# EAGLE design ext_motor_M (EAGLE 9.6.2)
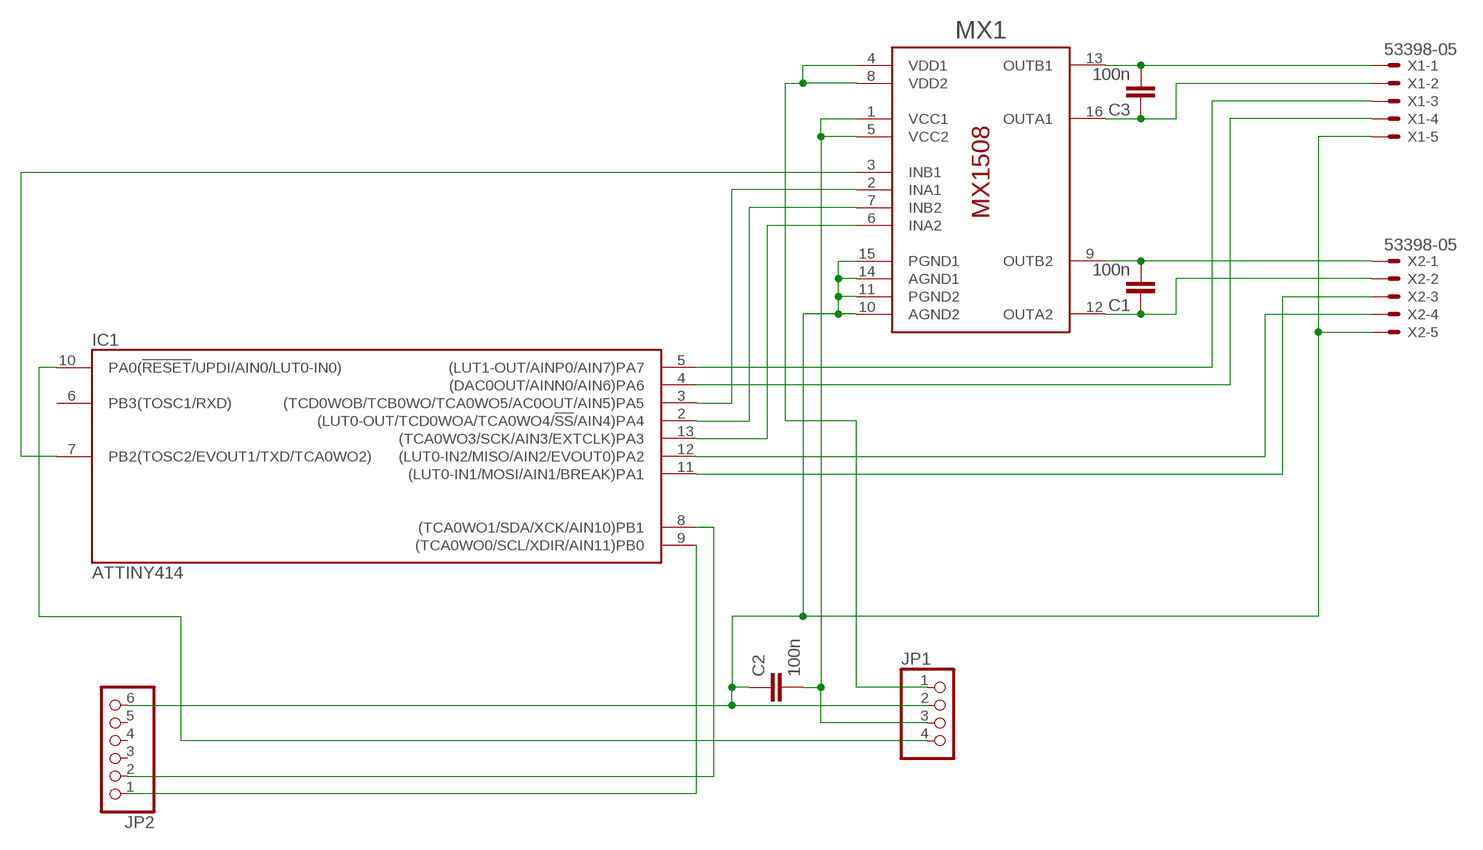
[diagram p0: schematic, sheet 1]

## Parts
C1  100n  C-EUC0805K  [C0805K]
C2  100n  C-EUC0805K  [C0805K]
C3  100n  C-EUC0805K  [C0805K]
IC1  ATTINY414  ATTINY414-SSN  [SO14]
JP1  PINHD-1X4  [1X04]
JP2  PINHD-1X6  [1X06]
MX1  MX1508  [SOP16]
X1  53398-05  [53398-05]
X2  53398-05  [53398-05]

## Nets
FOTO1: IC1.5((LUT1-OUT/AINP0/AIN7)PA7) X1.3
FOTO2: IC1.12((LUT0-IN2/MISO/AIN2/EVOUT0)PA2) X2.4
GND: C2.1 JP1.2 JP2.6 MX1.10(AGND2) MX1.11(PGND2) MX1.14(AGND1) MX1.15(PGND1) X1.5 X2.5
INA1: IC1.3((TCD0WOB/TCB0WO/TCA0WO5/AC0OUT/AIN5)PA5) MX1.2(INA1)
INA2: IC1.13((TCA0WO3/SCK/AIN3/EXTCLK)PA3) MX1.6(INA2)
INB1: IC1.7(PB2(TOSC2/EVOUT1/TXD/TCA0WO2)) MX1.3(INB1)
INB2: IC1.2((LUT0-OUT/TCD0WOA/TCA0WO4/!SS!/AIN4)PA4) MX1.7(INB2)
LED1: IC1.4((DAC0OUT/AINN0/AIN6)PA6) X1.4
LED2: IC1.11((LUT0-IN1/MOSI/AIN1/BREAK)PA1) X2.3
M1: C3.2 MX1.13(OUTB1) X1.1
M2: C3.1 MX1.16(OUTA1) X1.2
M3: C1.2 MX1.9(OUTB2) X2.1
M4: C1.1 MX1.12(OUTA2) X2.2
M_SRC: JP1.1 MX1.4(VDD1) MX1.8(VDD2)
N$7: IC1.10(PA0(!RESET!/UPDI/AIN0/LUT0-IN0)) JP1.4
N$19: IC1.9((TCA0WO0/SCL/XDIR/AIN11)PB0) JP2.1
N$20: IC1.8((TCA0WO1/SDA/XCK/AIN10)PB1) JP2.2
VCC: C2.2 JP1.3 MX1.1(VCC1) MX1.5(VCC2)
Unconnected: IC1.6(PB3(TOSC1/RXD)) JP2.3 JP2.4 JP2.5

## Power pins joined to a net without a drawn wire
GND: IC1.14(GND)
VCC: IC1.1(VCC)

## Library data of the parts
C1-C3 = rcl:C-EU: CAPACITOR, European symbol; SPICEPREFIX: C
IC1 = atmel:ATTINY*14: 8-bit AVR tiny-1-series Microcontroller CPU: two-cycle hardware multiplier single pin Unified Program Debug Interface (UPDI) programmable watchdog timer with separate on-chip oscillator programmable brown-out detection circuit with software disable function internal calibrated oscillator Status aktiv aktiv aktiv aktiv ATtiny214 ATtiny414 ATtiny814 ATtiny1614 General purpose working registers 32 SRAM 128 B 256 B 512 B 2 kB Program flash memory 2 kB 4 kB 8 kB 16 kB EEPROM 64 B 128 B 128 B 256 B 16-bit Timer/Counter type A (TCA) 1 16-bit Timer/Counter type B (TCB) 1 2 12-bit Timer/Counter type D (TCD) 1 Real Time Counter (RTC) 1 USART 1 SPI 1 TWI (I2C) 1 ADC 1 2 ADC channels 10 10+4 ADC resolution 10 bit DAC 1 3 AC 1 3 Peripheral Touch Controller (PTC) - 1 PTC number of self-capacitance channels - 6 PTC number of mutual-capacitance channels - 9 Custom Configurable Logic/Lookup tables 1/2 Window Watchdog 1 Event System channels 6 General purpose I/O 12 External interrupts 12 CRCSCAN 1 Operating voltage 1.8 ... 5.5 V Speed grade 0 ... 5 MHz @ 1.8 ... 5.5 V 0 ... 10 MHz @ 2.7 ... 5.5 V 0 ... 20 MHz @ 4.5 ... 5.5 V Clock options internal 16/20 MHz low power RC oscillator internal 32.768 kHz ultra low power RC oscillator external 32.768 kHz low-frequency crystal oscillator external clock input Pin Name Other/Special ADC0 ADC1 PTC AC0 AC1 AC2 DAC0 USART0 SPI0 TWI0 TCA0 TCBn TCD0 CCL PA0 !RESET, UPDI AIN0 LUT0-IN0 PA1 AIN1 TxD MOSI SDA LUT0-IN1 PA2 EVOUT0 AIN2 RxD MISO SCL LUT0-IN2 PA3 EXTCLK AIN3 XCK SCK WO3 TCB1 WO PA4 AIN4 AIN0 X0/Y0 XDIR !SS WO4 WOA LUT0-OUT PA5 VREFA AIN5 AIN1 X1/Y1 OUT AINN0 WO5 TCB0 WO WOB PA6 AIN6 AIN2 X2/Y2 AINN0 AINP1 AINP0 OUT PA7 AIN7 AIN3 X3/Y3 AINP0 AINP0 AINN0 LUT1-OUT PB3 TOSC1 OUT RxD WO0 PB2 TOSC2, EVOUT1 OUT TxD WO2 PB1 AIN10 X4/Y4 AINP2 XCK SDA WO1 PB0 AIN11 X5/Y5 AINP2 AINP1 XDIR SCL WO0 only available in devices with 8/16KByte flash, X- or Y-line only available in device ATtiny1614
JP1 = pinhead2:PINHD-1X4: PIN HEADER
JP2 = pinhead2:PINHD-1X6: PIN HEADER
MX1 = hugo:MX1508
X1 X2 = con-molex:53?-05: CONNECTOR wire to board 1.25 mm (.049 inch) pitch header; MF: MOLEX; OC_FARNELL: 1125354; OC_NEWARK: unknown

## Board
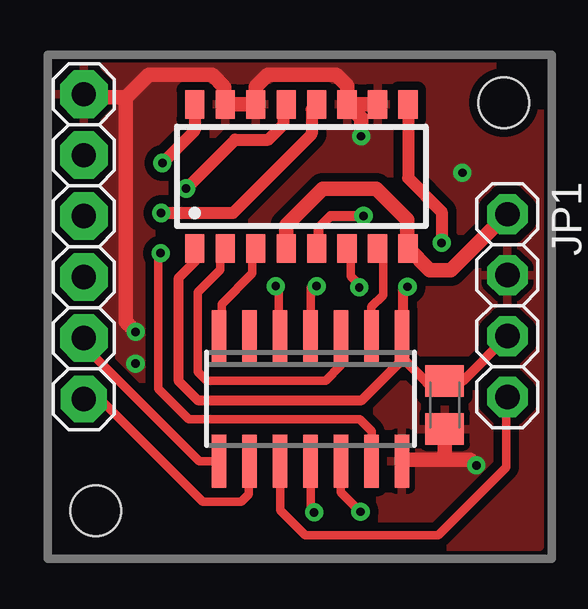
[diagram p1: board, top side]
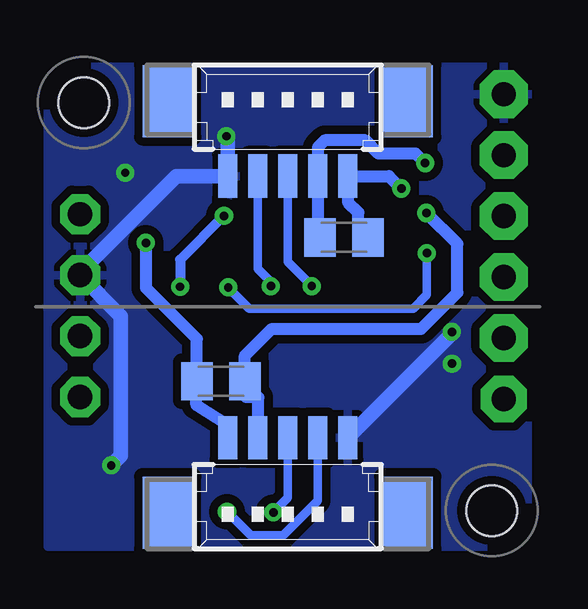
[diagram p2: board, bottom side, seen from below]

No outline drawn. Coordinates in mm, seen from the top.
Copper layers (1*16): Top 0.035mm / dielectric 1.5mm / Bottom 0.035mm
Design rules "default *": minimum track width 12mil, minimum drill 0.35mm, track to track 14mil, track to pad 13mil, pad to pad 10mil, via to via 14mil, smd to smd 14mil, copper to edge 15mil, drill to drill 15mil, minimum pad ring 10mil, minimum via ring 8mil, stop-mask expansion 4mil, vias tented up to drill 0mil, thermal gap 10mil
Holes 2.1 mm at 2,2 19,19

### Footprints (pad centres in the part's own frame; a part is rotated, then mirrored left to right if it is on the bottom)
C0805K = smd 1.3 x 1.6: 1 -1,0; 2 1,0
SO14 = smd 0.6 x 2.2: 1 -3.81,-2.6; 2 -2.54,-2.6; 3 -1.27,-2.6; 4 0,-2.6; 5 1.27,-2.6; 6 2.54,-2.6; 7 3.81,-2.6; 8 3.81,2.6; 9 2.54,2.6; 10 1.27,2.6; 11 0,2.6; 12 -1.27,2.6; 13 -2.54,2.6; 14 -3.81,2.6
1X04 = drill 1.016 pad 1.676 octagon: 1 -3.81,0; 2 -1.27,0; 3 1.27,0; 4 3.81,0
1X06 = drill 1.016 pad 1.93 octagon: 1 -6.35,0 | drill 1.016 pad 1.981 octagon: 2 -3.81,0; 3 -1.27,0; 4 1.27,0; 5 3.81,0; 6 6.35,0
SOP16 = smd 0.8 x 1.2: 1 -4.445,-3; 2 -3.175,-3; 3 -1.905,-3; 4 -0.635,-3; 5 0.635,-3; 6 1.905,-3; 7 3.175,-3; 8 4.445,-3; 9 4.445,3; 10 3.175,3; 11 1.905,3; 12 0.635,3; 13 -0.635,3; 14 -1.905,3; 15 -3.175,3; 16 -4.445,3
53398-05 = smd 0.8 x 1.8: 1 2.5,-2.5; 2 1.25,-2.5; 3 0,-2.5; 4 -1.25,-2.5; 5 -2.5,-2.5 | smd 2.1 x 3: S1 5,0.625; S2 -5,0.625

### Placement (x,y rotation side)
C1  13.28,7.39 180 bottom
C2  16.54,6.4 90 top
C3  8.15,13.39 0 bottom
IC1  10.95,6.65 180 top
JP1  19.15,10.54 270 top
JP2  1.5,13 90 top
MX1  10.57,15.93 0 top
X1  10.5,18.44 0 bottom
X2  10.5,2.54 180 bottom

### Tracks (layer width: path | path; a pad name or v marks a point on that pad's centre or on a via)
FOTO1  (via drill 0.35)
  Top 0.356: IC1.5 9.63,9.31 9.63,11.23 v9.5,11.35
  Bottom 0.356: v9.5,11.35 9.5,11.38 10.49,12.37 10.5,12.37 X1.3
FOTO2  (via drill 0.35)
  Top 0.356: IC1.12 12.22,2.77 v13.03,1.96
  Bottom 0.356: v13.03,1.96 12.04,0.96 10.69,0.96 9.25,2.41 X2.4
GND  (via drill 0.35)
  Top 0.61: C2.1 16.54,4.18 16.48,4.13 | 16.48,4.13 14.76,4.13 IC1.14 | MX1.11 MX1.10 | MX1.11 12.47,19.71 12.01,20.17 9.17,20.17 8.66,19.66 MX1.14 MX1.15 7.36,18.96 7.36,19.65 6.85,20.16 4.2,20.16 3.27,19.23 3.25,19.23 | v13.06,17.6 13.06,18.34 MX1.11 | 3.25,19.23 1.62,19.23 JP2.6 | 3.25,19.23 3.25,9.86 v3.66,9.45 | 16.48,4.13 17.61,4.13 v17.86,3.89
  Bottom 0.61: 8,5.11 X2.5 3.66,9.38 v3.66,9.45 | v13.06,17.6 13.06,17.58 13,17.52 X1.5 15.15,15.94 19.15,11.94 JP1.2 17.45,10.11 17.45,4.29 v17.86,3.89
  other vias: 17.27,16.08 3.66,8.13
  pour Top (isolate 0.305): 0.5,20.5 0.5,0.5 20.5,0.5 20.5,20.5
  pour Bottom (isolate 0.305): 0.5,20.5 0.5,0.5 20.5,0.5 20.5,20.5
INA1
  Top 0.356: IC1.3 12.22,8.05 11.58,7.42 6.63,7.42 6.25,7.79 6.25,11.1 7.2,12.04 7.2,12.73 MX1.2
INA2  (via drill 0.35)
  Top 0.356: IC1.13 13.51,4.08 13.51,5.31 13.01,5.82 5.87,5.82 4.6,7.08 4.6,12.63 v4.7,12.73 | MX1.6 12.62,12.77 12.62,11.76 13.03,11.35 v12.98,11.3
  Bottom 0.356: v12.98,11.3 12.98,11.28 12.11,10.42 5.27,10.42 4.7,10.99 v4.7,12.73
INB1
  Top 0.356: MX1.3 8.53,12.79 8.53,11.89 7.24,10.6 7.24,9.36 IC1.7
INB2
  Top 0.356: MX1.7 13.97,12.7 13.97,10.97 13.49,10.49 IC1.2
LED1  (via drill 0.35)
  Top 0.356: IC1.4 10.95,11.28 11.02,11.35 v11.2,11.35
  Bottom 0.356: v11.2,11.35 11.2,11.53 11.75,12.08 X1.4
LED2  (via drill 0.35)
  Top 0.356: IC1.11 10.95,2.08 v11.1,1.93
  Bottom 0.356: v11.1,1.93 10.5,2.53 X2.3
M1  (via drill 0.35)
  Top 0.508: v5.77,15.42 7.81,17.46 9.2,17.46 9.82,18.09 9.82,18.82 MX1.13
  Bottom 0.508: v5.77,15.42 6.29,15.94 X1.1 8,14.86 7.99,14.85 7.56,14.42 7.56,13.79 C3.2
M2  (via drill 0.35)
  Top 0.508: MX1.16 6.12,17.83 v4.78,16.48
  Bottom 0.508: 9.19,13.22 C3.1 9.17,13.37 9.26,13.37 9.28,13.4 9.25,13.58 X1.2 | X1.2 9.15,16.04 | v4.78,16.48 5.18,16.89 6.72,16.89 7.25,17.43 8.97,17.43 9.25,17.14 X1.2
M3  (via drill 0.35)
  Top 0.508: v16.41,13.16 16.41,14.46 15.01,15.86 MX1.9
  Bottom 0.356: 14.45,9.32 14.5,9.37
  Bottom 0.508: X2.1 13,5.58 14.31,6.41 14.31,7.37 C1.2 14.28,9.15 14.45,9.32 | v16.41,13.16 16.4,13.15 16.4,11.27 14.5,9.37
M4  (via drill 0.35)
  Top 0.508: v4.72,14.4 7.71,14.4 10.99,17.68 10.99,18.72 MX1.12
  Bottom 0.508: X2.2 11.73,6.72 12.23,6.73 12.23,7.34 C1.1 12.28,8.46 11.17,9.58 4.94,9.58 3.43,11.08 3.43,13.11 v4.72,14.4
M_SRC
  Top 0.61: MX1.4 9.93,13.89 11.46,15.42 13.68,15.42 14.98,14.12 14.98,12.96 MX1.8 15.93,12.01 16.79,12.01 19.13,14.35 JP1.1
N$7
  Top 0.356: 9.6,3.98 IC1.10 9.68,2.02 10.73,0.97 16.27,0.97 19.1,3.8 19.1,6.68 JP1.4
N$19
  Top 0.356: IC1.9 8.38,4.03 8.38,2.69 8.05,2.37 6.46,2.37 2.19,6.65 JP2.1
N$20
  Top 0.356: IC1.8 6.32,4.05 1.5,8.88 JP2.2
VCC  (via drill 0.35)
  Top 0.406: 6.28,12.77 MX1.1 6.12,12.37 5.46,11.71 5.46,7.39 6.25,6.6 13.09,6.6 14.68,8.2 14.68,9.18 IC1.1 | IC1.1 14.81,9.31 14.81,11.15 v14.99,11.33 | MX1.5 11.28,13.01 11.28,13.79 11.78,14.29 v13.16,14.29 | IC1.1 14.71,9.2 14.71,8.42 15.8,7.33 16.46,7.33 C2.2 17.28,7.4 JP1.3
  Bottom 0.406: v13.16,14.29 14.99,12.46 v14.99,11.33

### Text on the board
bDocu: moto M.0